# Altium schematic sheet Phase_Capacitor.SchDoc
size A3
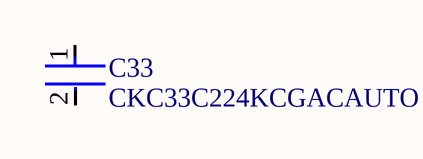
[diagram p0: Phase_Capacitor.SchDoc]

## Parts
C33  CKC33C224KCGACAUTO  [FP-CKC33C-IPC_A]

## Nets

Not connected (* = marked no-connect by the designer): C33 1 2

## Library data of the parts
C33 = CMP-03020-010018-1: KC-LINK 3640 220NF 500V C0G; Manufacturer: KEMET; Value: 0.22 uF; Material: Ceramic; Automotive Grade: Grade 0; Temperature Coefficient: 30ppm/°C; Tolerance: 0.1; RoHS: TRUE; ComponentLink2Description: Datasheet; Category: Cap; Temperature Range High: +150°C; Ipc Land Pattern Name: CAPC9301020X250; Height: 2.7mm; Temperature Characteristic: C0G; Automotive: Yes; Device Class L1: Passive Components; Digikey Description: KC-LINK 3640 220NF 500V C0G; Temperature Range Low: -55°C; Lead Free: Yes; Manufacturer Part Number: CKC33C224KCGACAUTO; Device Class L2: Capacitors; ComponentLink2URL: https://content.kemet.com/datasheets/KEM_C1039_KC-LINK_C0G.pdf; Octopart: https://octopart.com/ckc33c224kcgacauto-kemet-88954723; Mouser Description: Cap Ceramic 0.22uF 500V C0G 10% Pad SMD 3640 150C Automotive T/R; Voltage Rating: 500V; Temperature: -55°C to +150°C; Device Class L3: Ceramic Capacitors; Package: CKC33C; Capacitance: 0.22 uF